# Altium project Battman.PrjPcb (part 1 of 2)
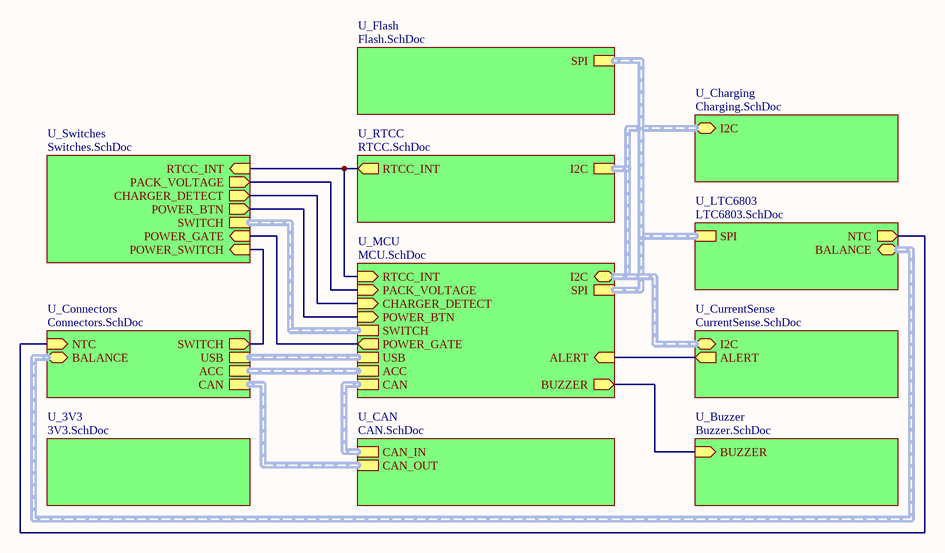
[diagram p0: BMS.SchDoc]
13 sheets, 248 parts. Net scope: hierarchical (ports join the sheet entries above them; power ports are global).
Board file: BMS.PcbDoc
Sheets:
  BMS.SchDoc
    U_3V3 = 3V3.SchDoc
    U_MCU = MCU.SchDoc
    U_Switches = Switches.SchDoc
    U_LTC6803 = LTC6803.SchDoc
      12 = Cell.SchDoc
      11 = Cell.SchDoc
      10 = Cell.SchDoc
      9 = Cell.SchDoc
      8 = Cell.SchDoc
      7 = Cell.SchDoc
      6 = Cell.SchDoc
      5 = Cell.SchDoc
      4 = Cell.SchDoc
      3 = Cell.SchDoc
      2 = Cell.SchDoc
      1 = Cell.SchDoc
    U_Charging = Charging.SchDoc
    U_Connectors = Connectors.SchDoc
    U_CurrentSense = CurrentSense.SchDoc
    U_CAN = CAN.SchDoc
    U_RTCC = RTCC.SchDoc
    U_Buzzer = Buzzer.SchDoc
    U_Flash = Flash.SchDoc

## Sheet BMS.SchDoc
size A; SheetNumber: 1

### Sub-sheets
U_3V3 = 3V3.SchDoc: no entries
U_Buzzer = Buzzer.SchDoc: BUZZER (in)
U_CAN = CAN.SchDoc: CAN_IN (harness CAN Input), CAN_OUT (harness CAN Output)
U_Charging = Charging.SchDoc: I2C (harness I2C)
U_Connectors = Connectors.SchDoc: USB (harness USB), ACC (harness Accessory Outputs), SWITCH (out), CAN (harness CAN Output), NTC (in), BALANCE (harness Balance)
U_CurrentSense = CurrentSense.SchDoc: ALERT (out), I2C (harness I2C)
U_Flash = Flash.SchDoc: SPI (harness SPI)
U_LTC6803 = LTC6803.SchDoc: SPI (harness SPI), NTC (out), BALANCE (harness Balance)
U_MCU = MCU.SchDoc: CHARGER_DETECT (in), POWER_BTN (in), POWER_GATE (out), SPI (harness SPI), USB (harness USB), CAN (harness CAN Input), ACC (harness Accessory Outputs), SWITCH (harness Switches), I2C (harness I2C), RTCC_INT (in), PACK_VOLTAGE (in), ALERT (in), BUZZER (out)
U_RTCC = RTCC.SchDoc: I2C (harness I2C), RTCC_INT (out)
U_Switches = Switches.SchDoc: POWER_GATE (in), POWER_BTN (out), CHARGER_DETECT (out), SWITCH (harness Switches), POWER_SWITCH (in), RTCC_INT (in), PACK_VOLTAGE (out)

### Nets
NetC1_2: sheet U_LTC6803/NTC, sheet U_Connectors/NTC
NetJP4_1: sheet U_Switches/POWER_SWITCH, sheet U_Connectors/SWITCH
NetQ1_1: sheet U_MCU/POWER_BTN, sheet U_Switches/POWER_BTN
NetQ9_1: sheet U_MCU/RTCC_INT, sheet U_Switches/RTCC_INT, sheet U_RTCC/RTCC_INT
NetQ11_1: sheet U_MCU/POWER_GATE, sheet U_Switches/POWER_GATE
NetQ13_1: sheet U_MCU/BUZZER, sheet U_Buzzer/BUZZER
NetR22_1: sheet U_MCU/PACK_VOLTAGE, sheet U_Switches/PACK_VOLTAGE
NetR39_1: sheet U_MCU/CHARGER_DETECT, sheet U_Switches/CHARGER_DETECT
NetR52_1: sheet U_MCU/ALERT, sheet U_CurrentSense/ALERT

### Buses and harness runs
harness sheet U_CAN/CAN_IN = sheet U_MCU/CAN
harness sheet U_CAN/CAN_OUT = sheet U_Connectors/CAN
harness sheet U_Charging/I2C = sheet U_CurrentSense/I2C = sheet U_MCU/I2C = sheet U_RTCC/I2C
harness sheet U_Connectors/ACC = sheet U_MCU/ACC
harness sheet U_Connectors/BALANCE = sheet U_LTC6803/BALANCE
harness sheet U_Connectors/USB = sheet U_MCU/USB
harness sheet U_Flash/SPI = sheet U_LTC6803/SPI = sheet U_MCU/SPI
harness sheet U_MCU/SWITCH = sheet U_Switches/SWITCH

## Sheet 3V3.SchDoc
size A; SheetNumber: 2
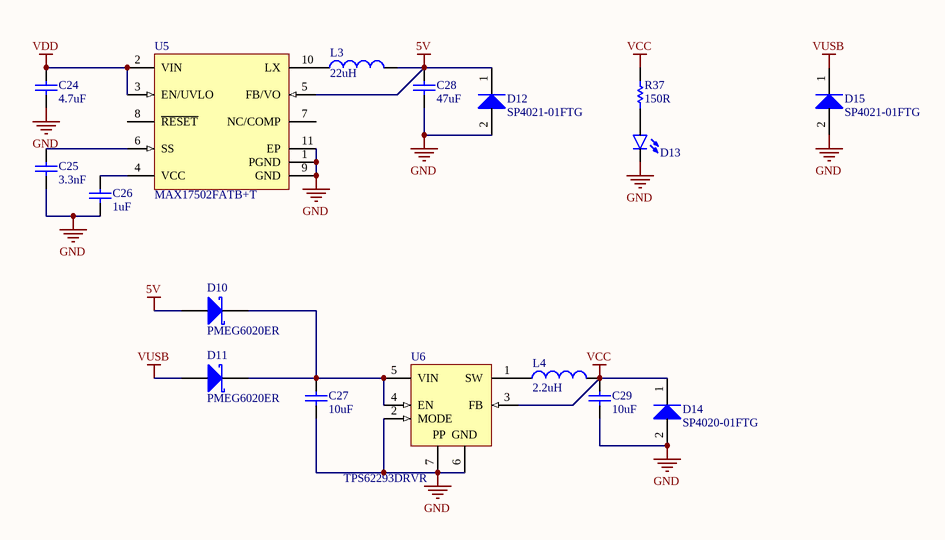
[diagram p1: 3V3.SchDoc]

### Parts
C24  value 4.7uF  [C1210[3225X200]]  (hidden comment: 4.7uF 100V 1210)
C25  value 3.3nF  [C0402[1005X55]]  (hidden comment: 3.3nF 50V 0402)
C26  value 1uF  [C0402[1005X55]]  (hidden comment: 1uF 6.3V 0402)
C27  value 10uF  [C0402[1005X55]]  (hidden comment: 10uF 6.3V 0402)
C28  value 47uF  [C1210[3225X250]]  (hidden comment: 47uF 6.3V 1210)
C29  value 10uF  [C0402[1005X55]]  (hidden comment: 10uF 6.3V 0402)
D10  PMEG6020ER  [SOD-123]
D11  PMEG6020ER  [SOD-123]
D12  SP4021-01FTG  [SOD-323]
D13  LED_0603_GREEN_5mA  [LED0603]  (value not drawn)
D14  SP4020-01FTG  [SOD323]
D15  SP4021-01FTG  [SOD-323]
L3  value 22uH  [SDR0604]
L4  2.2uH  [IND0805]
R37  value 150R  [R0402[1005]]  (hidden comment: 150R 1% 0402)
U5  MAX17502FATB+T  [TDFN-10-EP]
U6  TPS62293DRVR  [WSON-6]

### Nets
5V: C28.2 D10.2(A) D12.1(K) L3.2 U5.5(FB/VO)
GND: C24.1 C25.1 C26.1 C27.1 C28.1 C29.1 D12.2(A) D13.C D14.2(A) D15.2(A) U5.1(PGND) U5.9(GND) U5.11(EP) U6.2(MODE) U6.6(GND) U6.7(EP)
VCC: C29.2 D14.1(K) L4.2 R37.2 U6.3(FB)
VDD: C24.2 U5.2(VIN) U5.3(EN/UVLO)
VUSB: D11.2(A) D15.1(K)
NetC25_2: C25.2 U5.6(SS)
NetC26_2: C26.2 U5.4(VCC)
NetC27_2: C27.2 D10.1(K) D11.1(K) U6.4(EN) U6.5(VIN)
NetD13_A: D13.A R37.1
NetL3_1: L3.1 U5.10(LX)
NetL4_1: L4.1 U6.1(SW)

Not connected (* = marked no-connect by the designer): U5 7(NC/COMP) 8(~{RESET})

### Notes on the sheet
- (in symbol TPS62293DRVR) PP

### Library data of the parts
C24 = CAP_4.7uF_100V_1210_10%: 4.7uF 100V 10% 1210 (3225 Metric); PartNumber: GRJ32DC72A475KE11L; Manufacturer: Murata; Tolerance: 10%; Mounting Technology: Surface Mount; PackageReference: 1210; PackageDescription: 1210 (3225 Metric); Voltage: 100V
C25 = CAP_3.3nF_50V_0402_10%: 3.3nF 50V 10% 0402 (1005 Metric); PartNumber: GRM155R71H332KA01D; Manufacturer: Murata; Tolerance: 10%; Mounting Technology: Surface Mount; PackageReference: 0402; PackageDescription: 0402 (1005 Metric); Voltage: 50V
C26 = CAP_1uF_6.3V_0402_10%: 1uF 6.3V 10% 0402 (1005 Metric); PartNumber: GRM155R70J105KA12D; Manufacturer: Murata; Tolerance: 10%; Mounting Technology: Surface Mount; PackageReference: 0402; PackageDescription: 0402 (1005 Metric); Voltage: 6.3V
C27 C29 = CAP_10uF_6.3V_0402_20%: 10uF 6.3V 20% 0402 (1005 Metric); PartNumber: GRM155R60J106ME44D; Manufacturer: Murata; Tolerance: 20%; Mounting Technology: Surface Mount; PackageReference: 0402; PackageDescription: 0402 (1005 Metric); Voltage: 6.3V
C28 = CAP_47uF_6.3V_1210_10%: 47uF 6.3V 10% 1210 (3225 Metric); PartNumber: GRM32ER70J476KE20L; Manufacturer: Murata; Tolerance: 10%; Mounting Technology: Surface Mount; PackageReference: 1210; PackageDescription: 1210 (3225 Metric); Voltage: 6.3V
D10 D11 = PMEG6020ER: PartNumber: PMEG6020ER,115; Manufacturer: NXP Semiconductors; PackageReference: SOD-123W; PackageDescription: SOD, 2-Leads, Body 2.69x1.6mm; Mounting Technology: Surface Mount
D12 D15 = SP4021-01FTG: Manufacturer: Littelfuse; PartNumber: SP4021-01FTG; PackageReference: SOD-323-2; Mounting Technology: Surface Mount
D13 = LED_0603_GREEN_5mA: PartNumber: LTST-C193TGKT-5A; Manufacturer: Lite-On Inc.; PackageReference: 0603; PackageDescription: 0603 (1608 Metric); Mounting Technology: Surface Mount
D14 = SP4020-01FTG: Manufacturer: Littelfuse; PartNumber: SP4020-01FTG; PackageReference: SOD-323-2; Mounting Technology: Surface Mount
L3 = SDR0604-220YL: 22uH 30% 1.1A 0604; Manufacturer: Bourns; PartNumber: SDR0604-220YL; PackageReference: SDR0604; Mounting Technology: Surface Mount
L4 = IND_2.2uH_1.7A_0805_20%: 2.2uH 20% 1.7A 0805; PartNumber: LQM21PN2R2MGHL; Manufacturer: Murata; PackageReference: 0805; PackageDescription: 0805 (2012 metric); Value: 2.2uH; Mounting Technology: Surface Mount; Current: 1.7A
R37 = RES_150R_0402_1%: 150R 0.063W 1% 0402 (1005 Metric); Manufacturer: KOA Speer; PartNumber: RK73H1ETTP1500F; Power: 0.063W; Tolerance: 1%; Mounting Technology: Surface Mount; PackageReference: 0402; PackageDescription: 0402 (1005 Metric); ComponentLink1Description: Datasheet; ComponentLink1URL: http://www.koaspeer.com/catimages/Products/RK73H/RK73H.pdf
U5 = MAX17502FATB+T: Ultra-Small, High-Efficiency, Synchronous Step-Down DC-DC Converter, 4.5 to 60 V, 1 A, -40 to 125 degC, 10-Pin TDFN (T1032N+1), RoHS, Tape and Reel; Manufacturer: Maxim Integrated; Mounting Technology: Surface Mount; PartNumber: MAX17502FATB+T; PackageReference: TDFN-10-EP
U6 = TPS62293DRVR: Voltage Regulators - Switching Regulators 2.25MHz 1A Step-Down Cnvrtr; Manufacturer: Texas Instruments; PartNumber: TPS62293DRVR; PackageReference: WSON-6; PackageDescription: SON, 6-Leads, Body 2x2mm, Pitch 0.65mm, Thermal Pad 1.6x1mm, TI Recommended; Mounting Technology: Surface Mount

## Sheet MCU.SchDoc
size A; SheetNumber: 3
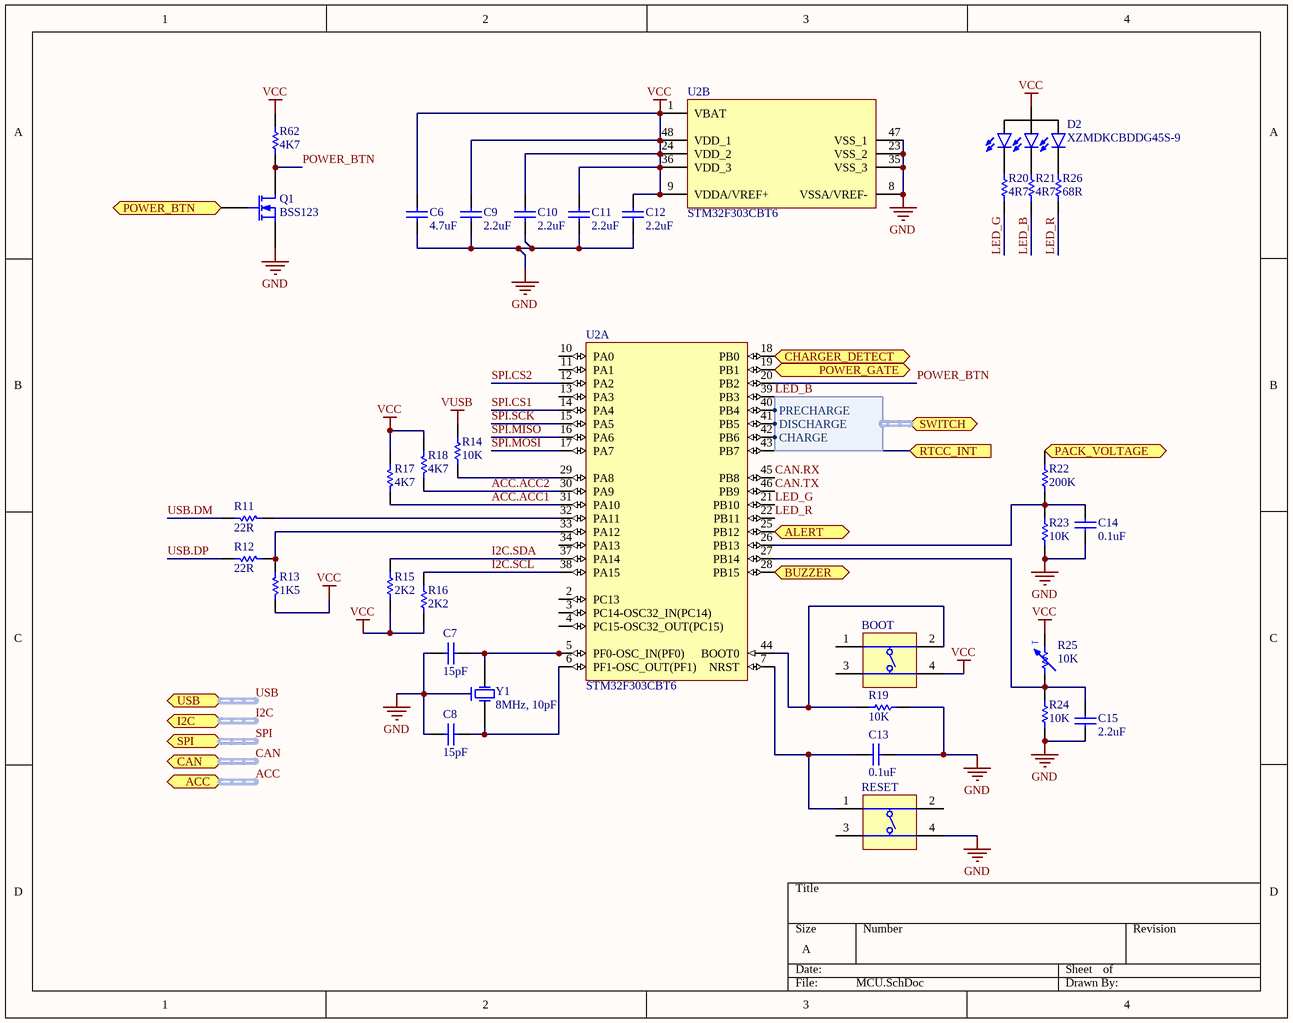
[diagram p2: MCU.SchDoc]

### Parts
BOOT  (no value)  [SWITCH]
C6  value 4.7uF  [C0402[1005X55]]  (hidden comment: 4.7uF 6.3V 0402)
C7  value 15pF  [C0402[1005X55]]  (hidden comment: 15pF 50V 0402)
C8  value 15pF  [C0402[1005X55]]  (hidden comment: 15pF 50V 0402)
C9  value 2.2uF  [C0402[1005X55]]  (hidden comment: 2.2uF 6.3V 0402)
C10  value 2.2uF  [C0402[1005X55]]  (hidden comment: 2.2uF 6.3V 0402)
C11  value 2.2uF  [C0402[1005X55]]  (hidden comment: 2.2uF 6.3V 0402)
C12  value 2.2uF  [C0402[1005X55]]  (hidden comment: 2.2uF 6.3V 0402)
C13  value 0.1uF  [C0402[1005X55]]  (hidden comment: 0.1uF 6.3V 0402)
C14  value 0.1uF  [C0402[1005X55]]  (hidden comment: 0.1uF 6.3V 0402)
C15  value 2.2uF  [C0402[1005X55]]  (hidden comment: 2.2uF 6.3V 0402)
D2  XZMDKCBDDG45S-9  [XZMDKCBDDG45S-9]
Q1  BSS123  [SOT323-3]
R11  value 22R  [R0402[1005]]  (hidden comment: 22R 1% 0402)
R12  value 22R  [R0402[1005]]  (hidden comment: 22R 1% 0402)
R13  value 1K5  [R0402[1005]]  (hidden comment: 1K5 1% 0402)
R14  value 10K  [R0402[1005]]  (hidden comment: 10K 1% 0402)
R15  value 2K2  [R0402[1005]]  (hidden comment: 2K2 1% 0402)
R16  value 2K2  [R0402[1005]]  (hidden comment: 2K2 1% 0402)
R17  value 4K7  [R0402[1005]]  (hidden comment: 4K7 1% 0402)
R18  value 4K7  [R0402[1005]]  (hidden comment: 4K7 1% 0402)
R19  value 10K  [R0402[1005]]  (hidden comment: 10K 1% 0402)
R20  value 4R7  [R0402[1005]]  (hidden comment: 4R7 1% 0402)
R21  value 4R7  [R0402[1005]]  (hidden comment: 4R7 1% 0402)
R22  value 200K  [R0402[1005]]  (hidden comment: 200K 1% 0402)
R23  value 10K  [R0402[1005]]  (hidden comment: 10K 1% 0402)
R24  value 10K  [R0402[1005]]  (hidden comment: 10K 1% 0402)
R25  value 10K  [R0402[1005]]  (hidden comment: 10K 0.5% 0402)
R26  value 68R  [R0402[1005]]  (hidden comment: 68R 1% 0402)
R62  value 4K7  [R0402[1005]]  (hidden comment: 4K7 1% 0402)
RESET  (no value)  [SWITCH]
U2  STM32F303CBT6  [LQFP-48]  (parts A,B of 2)
Y1  8MHz, 10pF  [ABRA-ABM3B-4_V]

### Ports
ACC (harness Accessory Outputs), ALERT (in), BUZZER (out), CAN (harness CAN Input), CHARGER_DETECT (in), I2C (harness I2C), PACK_VOLTAGE (in), POWER_BTN (in), POWER_GATE (out), RTCC_INT (in), SPI (harness SPI), SWITCH (harness Switches), USB (harness USB)

### Harnesses
Switches: CHARGE, DISCHARGE, PRECHARGE

### Nets
GND: C6.1 C7.1 C8.1 C9.1 C10.1 C11.1 C12.1 C13.2 C14.1 C15.1 Q1.2(S) R19.2 R23.1 R24.1 RESET.4(T3) U2.8(VSSA/VREF-) U2.23(VSS_2) U2.35(VSS_3) U2.47(VSS_1) Y1.2
VCC: BOOT.4(T3) C6.2 C9.2 C10.2 C11.2 C12.2 D2.2(A) R13.1 R15.2 R16.2 R17.2 R18.2 R25.2 R62.2 U2.1(VBAT) U2.9(VDDA/VREF+) U2.24(VDD_2) U2.36(VDD_3) U2.48(VDD_1)
VUSB: R14.2
ACC.ACC1: R17.1 U2.31(PA10)
ACC.ACC2: R18.1 U2.30(PA9)
CAN.RX: U2.45(PB8)
CAN.TX: U2.46(PB9)
I2C.SCL: R16.1 U2.38(PA15)
I2C.SDA: R15.1 U2.37(PA14)
LED_B: R21.1 U2.39(PB3)
LED_G: R20.1 U2.21(PB10)
LED_R: R26.1 U2.22(PB11)
POWER_BTN: Q1.3(D) R62.1 U2.20(PB2)
SPI.CS1: U2.14(PA4)
SPI.CS2: U2.12(PA2)
SPI.MISO: U2.16(PA6)
SPI.MOSI: U2.17(PA7)
SPI.SCK: U2.15(PA5)
USB.DM: R11.2
USB.DP: R12.2
NetBOOT_2: BOOT.2(T2) R19.1 U2.44(BOOT0)
NetC7_2: C7.2 U2.5(PF0-OSC_IN(PF0)) Y1.1(X1)
NetC8_2: C8.2 U2.6(PF1-OSC_OUT(PF1)) Y1.3(X2)
NetC13_1: C13.1 RESET.1(T1) U2.7(NRST)
NetC14_2: C14.2 R22.2 R23.2 U2.26(PB13)
NetC15_2: C15.2 R24.2 R25.1 U2.27(PB14)
NetD2_1: D2.1(K_Red) R26.2
NetD2_3: D2.3(K_Blue) R21.2
NetD2_4: D2.4(K_Green) R20.2
NetQ1_1: Q1.1(G) ; port POWER_BTN
NetQ9_1: U2.43(PB7) ; port RTCC_INT
NetQ11_1: U2.19(PB1) ; port POWER_GATE
NetQ13_1: U2.28(PB15) ; port BUZZER
NetR11_1: R11.1 U2.32(PA11)
NetR12_1: R12.1 R13.2 U2.33(PA12)
NetR14_1: R14.1 U2.29(PA8)
NetR22_1: R22.1 ; port PACK_VOLTAGE
NetR39_1: U2.18(PB0) ; port CHARGER_DETECT
NetR52_1: U2.25(PB12) ; port ALERT
NetU2_40: U2.40(PB4) ; port SWITCH.PRECHARGE
NetU2_41: U2.41(PB5) ; port SWITCH.DISCHARGE
NetU2_42: U2.42(PB6) ; port SWITCH.CHARGE

Not connected (* = marked no-connect by the designer): BOOT 1(T1) 3(T3); RESET 2(T2) 3(T3); U2 2(PC13) 3(PC14-OSC32_IN(PC14)) 4(PC15-OSC32_OUT(PC15)) 10(PA0) 11(PA1) 13(PA3) 34(PA13)

### Buses and harness runs
harness ACC = port ACC
harness CAN = port CAN
harness I2C = port I2C
harness SPI = port SPI
harness USB = port USB

### Notes on the sheet
- (in symbol NTC_10K_0402_0.5%) T

### Library data of the parts
BOOT RESET = DIPT-DTSM-6: Switch, SPNO Push Button SMD; Manufacturer: C&K Components; PartNumber: PTS810 SJM 250 SMTR LFS; Packing Type: Tape&Reel; Mechanical Life: 200,000 cycles; ComponentLink2URL: http://www.dip.com.tw/Products_tact.htm; ComponentLink1URL: http://www.dip.com.tw/; ComponentLink3URL: http://www.dip.com.tw/PDF/pro_tact/DTSM_G_-6_2_-V.pdf; PackageDescription: Switch, Surface Mount, 4 Leads, Body 4.6x2.8mm, Height 1.9mm; ComponentLink2Description: Datasheet; ComponentLink3Description: Package Specification; ComponentLink1Description: Manufacturer URL; PackageReference: PTS810; Mounting Technology: Surface Mount
C6 = CAP_4.7uF_6.3V_0402_20%: 4.7uF 6.3V 20% 0402 (1005 Metric); PartNumber: GRM155R60J475ME47D; Manufacturer: Murata; Tolerance: 20%; Mounting Technology: Surface Mount; PackageReference: 0402; PackageDescription: 0402 (1005 Metric); Voltage: 6.3V
C7 C8 = CAP_15pF_50V_0402_5%: 15pF 50V 5% 0402 (1005 Metric); PartNumber: GRM1555C1H150JA01D; Manufacturer: Murata; Tolerance: 5%; Mounting Technology: Surface Mount; PackageReference: 0402; PackageDescription: 0402 (1005 Metric); Voltage: 50V
C9-C12 C15 = CAP_2.2uF_6.3V_0402_20%: 2.2uF 6.3V 20% 0402 (1005 Metric); PartNumber: GRM155R60J225ME15D; Manufacturer: Murata; Tolerance: 20%; Mounting Technology: Surface Mount; PackageReference: 0402; PackageDescription: 0402 (1005 Metric); Voltage: 6.3V
C13 C14 = CAP_0.1uF_6.3V_0402_10%: 0.1uF 6.3V 10% 0402 (1005 Metric); PartNumber: GRM155R70J104KA01D; Manufacturer: Murata; Tolerance: 10%; Mounting Technology: Surface Mount; PackageReference: 0402; PackageDescription: 0402 (1005 Metric); Voltage: 6.3V
D2 = XZMDKCBDDG45S-9: Manufacturer: SunLED; PartNumber: XZMDKCBDDG45S-9; PackageReference: 4-PLCC; Mounting Technology: Surface Mount; PackageDescription: 4-SMD, Gull Wing,  3.20mm L x 2.80mm W
Q1 = BSS123WQ-7-F: N-Channel MOSFET; Manufacturer: Diodes Incorporated; PackageReference: SOT-323-3; PartNumber: BSS123WQ-7-F; Mounting Technology: Surface Mount
R11 R12 = RES_22R_0402_1%: 22R 0.063W 1% 0402 (1005 Metric); Manufacturer: KOA Speer; PartNumber: RK73H1ETTP22R0F; Power: 0.063W; Tolerance: 1%; Mounting Technology: Surface Mount; PackageReference: 0402; PackageDescription: 0402 (1005 Metric); ComponentLink1Description: Datasheet; ComponentLink1URL: http://www.koaspeer.com/catimages/Products/RK73H/RK73H.pdf
R13 = RES_1K5_0402_1%: 1K5 0.063W 1% 0402 (1005 Metric); Manufacturer: KOA Speer; PartNumber: RK73H1ETTP1501F; Tolerance: 1%; Power: 0.063W; Mounting Technology: Surface Mount; PackageReference: 0402; PackageDescription: 0402 (1005 Metric); ComponentLink1Description: Datasheet; ComponentLink1URL: http://www.koaspeer.com/catimages/Products/RK73H/RK73H.pdf
R14 R19 R23 R24 = RES_10K_0402_1%: 10K 0.063W 1% 0402 (1005 Metric); Manufacturer: KOA Speer; PartNumber: RK73H1ETTP1002F; Tolerance: 1%; Power: 0.063W; Mounting Technology: Surface Mount; PackageReference: 0402; PackageDescription: 0402 (1005 Metric); ComponentLink1Description: Datasheet; ComponentLink1URL: http://www.koaspeer.com/catimages/Products/RK73H/RK73H.pdf
R15 R16 = RES_2K2_0402_1%: 2K2 0.063W 1% 0402 (1005 Metric); Manufacturer: KOA Speer; PartNumber: RK73H1ETTP2201F; Tolerance: 1%; Power: 0.063W; Mounting Technology: Surface Mount; PackageReference: 0402; PackageDescription: 0402 (1005 Metric); ComponentLink1Description: Datasheet; ComponentLink1URL: http://www.koaspeer.com/catimages/Products/RK73H/RK73H.pdf
R17 R18 R62 = RES_4K7_0402_1%: 4K7 0.063W 1% 0402 (1005 Metric); Manufacturer: KOA Speer; PartNumber: RK73H1ETTP4701F; Tolerance: 1%; Power: 0.063W; Mounting Technology: Surface Mount; PackageReference: 0402; PackageDescription: 0402 (1005 Metric); ComponentLink1Description: Datasheet; ComponentLink1URL: http://www.koaspeer.com/catimages/Products/RK73H/RK73H.pdf
R20 R21 = RES_4R7_0402_1%: 4R7 0.063W 1% 0402 (1005 Metric); Manufacturer: KOA Speer; PartNumber: RK73H1ETTP4R70F; Power: 0.063W; Tolerance: 1%; Mounting Technology: Surface Mount; PackageReference: 0402; PackageDescription: 0402 (1005 Metric); ComponentLink1Description: Datasheet; ComponentLink1URL: http://www.koaspeer.com/catimages/Products/RK73H/RK73H.pdf
R22 = RES_200K_0402_1%: 200K 0.063W 1% 0402 (1005 Metric); Manufacturer: KOA Speer; PartNumber: RK73H1ETTP2003F; Tolerance: 1%; Power: 0.063W; Mounting Technology: Surface Mount; PackageReference: 0402; PackageDescription: 0402 (1005 Metric); ComponentLink1Description: Datasheet; ComponentLink1URL: http://www.koaspeer.com/catimages/Products/RK73H/RK73H.pdf
R25 = NTC_10K_0402_0.5%: NTC 10K 0.5% 0402 (1005 Metric); PartNumber: NCP15XH103D03RC; Manufacturer: Murata; Power: 0.1W; Tolerance: 0.5%; Mounting Technology: Surface Mount; PackageReference: 0402; PackageDescription: 0402 (1005 Metric)
R26 = RES_68R_0402_1%: 68R 0.063W 1% 0402 (1005 Metric); Manufacturer: KOA Speer; PartNumber: RK73H1ETTP68R0F; Tolerance: 1%; Power: 0.063W; Mounting Technology: Surface Mount; PackageReference: 0402; PackageDescription: 0402 (1005 Metric); ComponentLink1Description: Datasheet; ComponentLink1URL: http://www.koaspeer.com/catimages/Products/RK73H/RK73H.pdf
U2 = STM32F303CBT6: Manufacturer: STMicroelectronics; PackageReference: LQFP-48; Mounting Technology: Surface Mount; PartNumber: STM32F303CBT6; PackageDescription: QFP, 48-Leads, Body 7x7mm, Pitch 0.5mm
Y1 = ABRA-ABM3B-4: PartNumber: ABM3B-8.000MHZ-10-1UT; Manufacturer: ABRACON; Mounting Technology: Surface Mount; PackageReference: 2012; PackageDescription: 2012 (5032 metric)

## Sheet Switches.SchDoc
size A; SheetNumber: 7
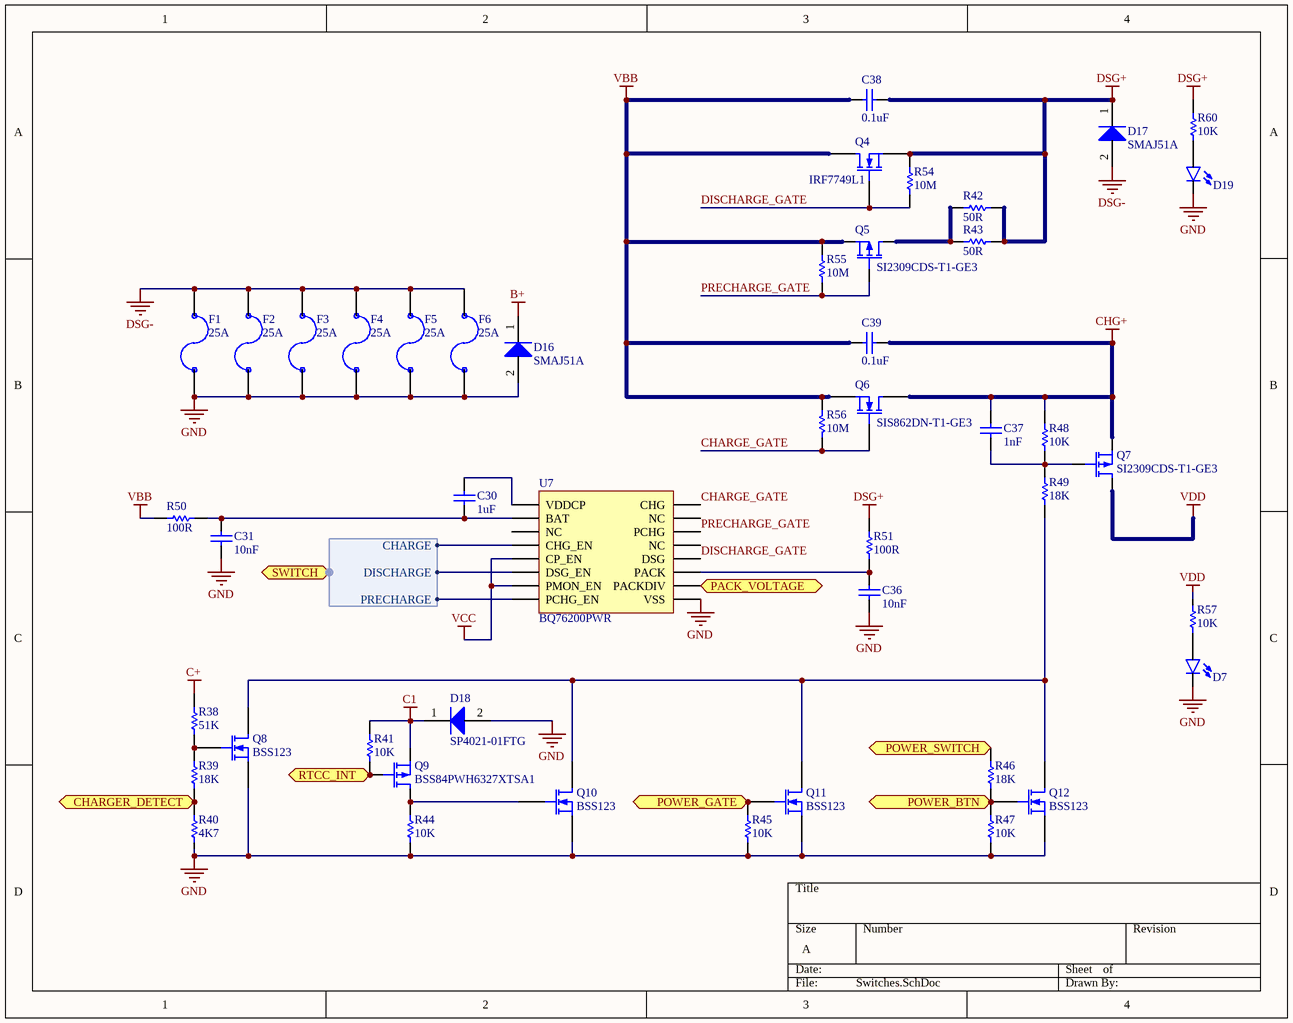
[diagram p3: Switches.SchDoc]

### Parts
C30  value 1uF  [C0603[1608X92]]  (hidden comment: 1uF 50V 0603)
C31  value 10nF  [C0402[1005X55]]  (hidden comment: 10nF 100V 0402)
C36  value 10nF  [C0402[1005X55]]  (hidden comment: 10nF 100V 0402)
C37  value 1nF  [C0402[1005X55]]  (hidden comment: 1nF 50V 0402)
C38  value 0.1uF  [C0402[1005X55]]  (hidden comment: 0.1uF 100V 0402)
C39  value 0.1uF  [C0402[1005X55]]  (hidden comment: 0.1uF 100V 0402)
D7  LED-BLUE  [LED0603]  (value not drawn)
D16  SMAJ51A  [DO-214AC]
D17  SMAJ51A  [DO-214AC]
D18  SP4021-01FTG  [SOD-323]
D19  LED-BLUE  [LED0603]  (value not drawn)
F1  Current: 25A  [1206_FUSE]  (hidden comment: FUSE 1206)
F2  Current: 25A  [1206_FUSE]  (hidden comment: FUSE 1206)
F3  Current: 25A  [1206_FUSE]  (hidden comment: FUSE 1206)
F4  Current: 25A  [1206_FUSE]  (hidden comment: FUSE 1206)
F5  Current: 25A  [1206_FUSE]  (hidden comment: FUSE 1206)
F6  Current: 25A  [1206_FUSE]  (hidden comment: FUSE 1206)
Q4  IRF7749L1  [DIRECTFET-9]
Q5  SI2309CDS-T1-GE3  [SOT23-3]
Q6  SIS862DN-T1-GE3  [PowerPak-1212-8]
Q7  SI2309CDS-T1-GE3  [SOT23-3]
Q8  BSS123  [SOT323-3]
Q9  BSS84PWH6327XTSA1  [SOT323-3]
Q10  BSS123  [SOT323-3]
Q11  BSS123  [SOT323-3]
Q12  BSS123  [SOT323-3]
R38  value 51K  [R0402[1005]]  (hidden comment: 51K 1% 0402)
R39  value 18K  [R0402[1005]]  (hidden comment: 18K 1% 0402)
R40  value 4K7  [R0402[1005]]  (hidden comment: 4K7 1% 0402)
R41  value 10K  [R0402[1005]]  (hidden comment: 10K 1% 0402)
R42  value 50R  [R1206[3216]]  (hidden comment: 50R 2% 1206)
R43  value 50R  [R1206[3216]]  (hidden comment: 50R 2% 1206)
R44  value 10K  [R0402[1005]]  (hidden comment: 10K 1% 0402)
R45  value 10K  [R0402[1005]]  (hidden comment: 10K 1% 0402)
R46  value 18K  [R0402[1005]]  (hidden comment: 18K 1% 0402)
R47  value 10K  [R0402[1005]]  (hidden comment: 10K 1% 0402)
R48  value 10K  [R0402[1005]]  (hidden comment: 10K 1% 0402)
R49  value 18K  [R0402[1005]]  (hidden comment: 18K 1% 0402)
R50  value 100R  [R0402[1005]]  (hidden comment: 100R 1% 0402)
R51  value 100R  [R0402[1005]]  (hidden comment: 100R 1% 0402)
R54  value 10M  [R0402[1005]]  (hidden comment: 10M 1% 0402)
R55  value 10M  [R0402[1005]]  (hidden comment: 10M 1% 0402)
R56  value 10M  [R0402[1005]]  (hidden comment: 10M 1% 0402)
R57  value 10K  [R0603[1608]]  (hidden comment: 10K 1% 0603)
R60  value 10K  [R0603[1608]]  (hidden comment: 10K 1% 0603)
U7  BQ76200PWR  [TSSOP-16]

### Ports
CHARGER_DETECT (out), PACK_VOLTAGE (out), POWER_BTN (out), POWER_GATE (in), POWER_SWITCH (in), RTCC_INT (in), SWITCH (harness Switches)

### Harnesses
Switches: CHARGE, DISCHARGE, PRECHARGE

### Nets
B+: D16.1(K)
C1: D18.1(K) Q9.2(S) R41.2
C+: R38.2
CHG+: C37.2 C39.2 Q6.3(D) Q7.3(S) R48.2
DSG+: C38.2 D17.1(K) Q4.2(S) R42.2 R43.2 R51.2 R54.2 R60.2
DSG-: D17.2(A) F1.1 F2.1 F3.1 F4.1 F5.1 F6.1
GND: C31.1 C36.1 D7.C D16.2(A) D18.2(A) D19.C F1.2 F2.2 F3.2 F4.2 F5.2 F6.2 Q8.2(S) Q10.2(S) Q11.2(S) Q12.2(S) R40.1 R44.1 R45.1 R47.1 U7.9(VSS)
VBB: C38.1 C39.1 Q4.3(D) Q5.3(S) Q6.1(S) R50.1 R55.2 R56.2
VCC: U7.5(CP_EN) U7.7(PMON_EN)
VDD: Q7.2(D) R57.2
CHARGE_GATE: Q6.2(G) R56.1 U7.16(CHG)
DISCHARGE_GATE: Q4.1(G) R54.1 U7.12(DSG)
PRECHARGE_GATE: Q5.1(G) R55.1 U7.14(PCHG)
NetC30_1: C30.1 C31.2 R50.2 U7.2(BAT)
NetC30_2: C30.2 U7.1(VDDCP)
NetC36_2: C36.2 R51.1 U7.11(PACK)
NetC37_1: C37.1 Q7.1(G) R48.1 R49.2
NetD7_A: D7.A R57.1
NetD19_A: D19.A R60.1
NetJP4_1: R46.2 ; port POWER_SWITCH
NetQ1_1: Q12.1(G) R46.1 R47.2 ; port POWER_BTN
NetQ5_2: Q5.2(D) R42.1 R43.1
NetQ8_1: Q8.1(G) R38.1 R39.2
NetQ8_3: Q8.3(D) Q10.3(D) Q11.3(D) Q12.3(D) R49.1
NetQ9_1: Q9.1(G) R41.1 ; port RTCC_INT
NetQ9_3: Q9.3(D) Q10.1(G) R44.2
NetQ11_1: Q11.1(G) R45.2 ; port POWER_GATE
NetR22_1: U7.10(PACKDIV) ; port PACK_VOLTAGE
NetR39_1: R39.1 R40.2 ; port CHARGER_DETECT
NetU2_40: U7.8(PCHG_EN) ; port SWITCH.PRECHARGE
NetU2_41: U7.6(DSG_EN) ; port SWITCH.DISCHARGE
NetU2_42: U7.4(CHG_EN) ; port SWITCH.CHARGE

Not connected (* = marked no-connect by the designer): U7 3(NC) 13(NC) 15(NC)

### Library data of the parts
C30 = CAP_1uF_50V_0603_10%: 1uF 50V 10% 0603 (1608 Metric); PartNumber: GRM188R61H105KAALD; Manufacturer: Murata; Tolerance: 10%; Mounting Technology: Surface Mount; PackageReference: 0603; PackageDescription: 0603 (1608 Metric); Voltage: 50V
C31 C36 = CAP_10nF_100V_0402_10%: 10nF 100V 10% 0402 (1005 Metric); PartNumber: C1005X7S2A103K050BB; Manufacturer: TDK; Tolerance: 10%; Mounting Technology: Surface Mount; PackageReference: 0402; PackageDescription: 0402 (1005 Metric); Voltage: 100V
C37 = CAP_1nF_50V_0402_5%: 1nF 50V 5% 0402 (1005 Metric); PartNumber: GRM1555C1H102JA01D; Manufacturer: Murata; Mounting Technology: Surface Mount; PackageReference: 0402; PackageDescription: 0402 (1005 Metric); Voltage: 50V; Tolerance: 5%
C38 C39 = CAP_0.1uF_100V_0402_10%: 0.1uF 100V 10% 0402 (1005 Metric); PartNumber: GRM155R62A104KE14D; Manufacturer: Murata; Mounting Technology: Surface Mount; PackageReference: 0402; PackageDescription: 0402 (1005 Metric); Voltage: 100V; Tolerance: 10%
D7 D19 = LED_0603_GREEN_5mA: as D13 on sheet 3V3; PackageReference: 0603; PackageDescription: 0603 (1608 Metric); Mounting Technology: Surface Mount
D16 D17 = SMAJ51A-E3/61: Manufacturer: Vishay; PartNumber: SMAJ51A-E3/61; PackageReference: DO-214AC; Mounting Technology: Surface Mount; PackageDescription: DO-214AC, 2 Leads
D18 = SP4021-01FTG: Manufacturer: Littelfuse; PartNumber: SP4021-01FTG; PackageReference: SOD-323-2; Mounting Technology: Surface Mount
F1-F6 = FUSE 1206: Surface Mount Fuses UST 1206 FUSE 25A F; PartNumber: 3413.0332.22; Manufacturer: Schurter; Mounting Technology: Surface Mount; PackageReference: 1206; PackageDescription: 1206 (3216 Metric)
Q4 = IRF7749L2: N-Channel MOSFET; PartNumber: IRF7749L1TRPBF; Manufacturer: Infineon Technologies; PackageReference: DIRECTFET L8; PackageDescription: DirectFET™ Isometric L8; Mounting Technology: Surface Mount
Q5 Q7 = SI2309CDS-T1-GE3: P-Channel MOSFET; Manufacturer: Vishay; PackageReference: SOT23-3; Mounting Technology: Surface Mount; PartNumber: SI2309CDS-T1-GE3
Q6 = SIS862DN-T1-GE3: N-Channel MOSFET; Manufacturer: Vishay; PackageReference: PowerPAK-1212-8; PartNumber: SIS862DN-T1-GE3; Mounting Technology: Surface Mount
Q8 Q10-Q12 = BSS123WQ-7-F: as Q1 on sheet MCU; PackageReference: SOT-323-3; PartNumber: BSS123WQ-7-F; Mounting Technology: Surface Mount
Q9 = BSS84PW H6327: P-Channel MOSFET; Manufacturer: Infineon; Mounting Technology: Surface Mount; PartNumber: BSS84PWH6327XTSA1; PackageReference: SOT323-3
R38 = RES_51K_0402_1%: 51K 0.063W 1% 0402 (1005 Metric); Manufacturer: KOA Speer; PartNumber: RK73H1ETTP5102F; Power: 0.063W; Tolerance: 1%; Mounting Technology: Surface Mount; PackageReference: 0402; PackageDescription: 0402 (1005 Metric); ComponentLink1Description: Datasheet; ComponentLink1URL: http://www.koaspeer.com/catimages/Products/RK73H/RK73H.pdf
R39 R46 R49 = RES_18K_0402_1%: 18K 0.063W 1% 0402 (1005 Metric); Manufacturer: KOA Speer; PartNumber: RK73H1ETTP1802F; Tolerance: 1%; Power: 0.063W; Mounting Technology: Surface Mount; PackageReference: 0402; PackageDescription: 0402 (1005 Metric); ComponentLink1Description: Datasheet; ComponentLink1URL: http://www.koaspeer.com/catimages/Products/RK73H/RK73H.pdf
R40 = RES_4K7_0402_1%: as R17 on sheet MCU; Tolerance: 1%; Power: 0.063W; Mounting Technology: Surface Mount; PackageReference: 0402; PackageDescription: 0402 (1005 Metric); ComponentLink1Description: Datasheet; ComponentLink1URL: http://www.koaspeer.com/catimages/Products/RK73H/RK73H.pdf
R41 R44 R45 R47 R48 = RES_10K_0402_1%: as R14 on sheet MCU; Tolerance: 1%; Power: 0.063W; Mounting Technology: Surface Mount; PackageReference: 0402; PackageDescription: 0402 (1005 Metric); ComponentLink1Description: Datasheet; ComponentLink1URL: http://www.koaspeer.com/catimages/Products/RK73H/RK73H.pdf
R42 R43 = RES_50R_1206_2%: 50R 2.4W 2% 1206 (3216 Metric); Manufacturer: Vishay; PartNumber: RCP1206W50R0GEB; Tolerance: 2%; Power: 2.4W; Mounting Technology: Surface Mount; PackageReference: 1206; PackageDescription: 1206 (3216 Metric); ComponentLink1Description: Datasheet; ComponentLink1URL: http://www.vishay.com/docs/31098/rcp.pdf
R50 R51 = RES_100R_0402_1%: 100R 0.063W 1% 0402 (1005 Metric); Manufacturer: KOA Speer; PartNumber: RK73H1ETTP1000F; Power: 0.063W; Tolerance: 1%; Mounting Technology: Surface Mount; PackageReference: 0402; PackageDescription: 0402 (1005 Metric); ComponentLink1Description: Datasheet; ComponentLink1URL: http://www.koaspeer.com/catimages/Products/RK73H/RK73H.pdf
R54-R56 = RES_10M_0402_1%: 10M 0.063W 1% 0402 (1005 Metric); Manufacturer: KOA Speer; PartNumber: RK73H1ETTP1005F; Tolerance: 1%; Power: 0.063W; Mounting Technology: Surface Mount; PackageReference: 0402; PackageDescription: 0402 (1005 Metric); ComponentLink1Description: Datasheet; ComponentLink1URL: http://www.koaspeer.com/catimages/Products/RK73H/RK73H.pdf
R57 R60 = RES_10K_0603_1%: 10K 0.25W 1% 0603 (1005 Metric); Manufacturer: Vishay; PartNumber: RCS060310K0FKEA; Tolerance: 1%; Power: 0.25W; Mounting Technology: Surface Mount; PackageReference: 0603; PackageDescription: 0603 (1608 Metric); ComponentLink1Description: Datasheet; ComponentLink1URL: http://www.vishay.com/docs/20065/rcse3.pdf
U7 = BQ76200PWR: Battery Management Fast high side NCH drive; Manufacturer: Texas Instruments; PartNumber: BQ76200PWR; PackageReference: TSSOP-16; Mounting Technology: Surface Mount

## Sheet LTC6803.SchDoc
size A; SheetNumber: 4
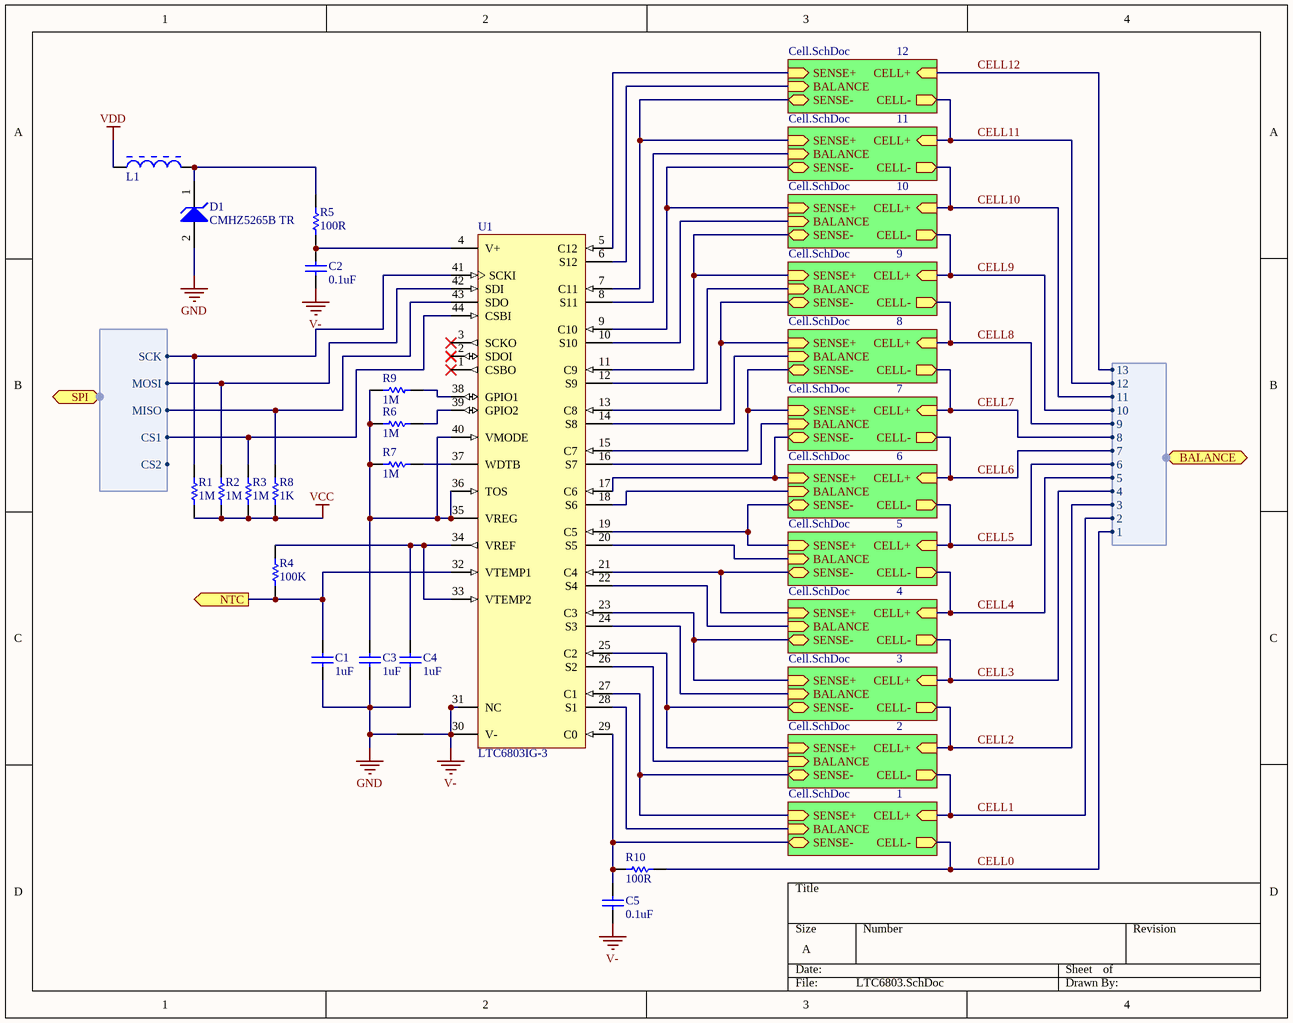
[diagram p4: LTC6803.SchDoc]

### Parts
*  NetTie  [NetTie]  (value not drawn)  (net tie, no BOM)
C1  value 1uF  [C0402[1005X55]]  (hidden comment: 1uF 6.3V 0402)
C2  value 0.1uF  [C0402[1005X55]]  (hidden comment: 0.1uF 100V 0402)
C3  value 1uF  [C0402[1005X55]]  (hidden comment: 1uF 6.3V 0402)
C4  value 1uF  [C0402[1005X55]]  (hidden comment: 1uF 6.3V 0402)
C5  value 0.1uF  [C0402[1005X55]]  (hidden comment: 0.1uF 6.3V 0402)
D1  CMHZ5265B TR  [SOD-123]
L1  MURA-FB-2  [MURA-BLM31-B60-CHIP-2_V3]  (value not drawn)
R1  value 1M  [R0402[1005]]  (hidden comment: 1M 1% 0402)
R2  value 1M  [R0402[1005]]  (hidden comment: 1M 1% 0402)
R3  value 1M  [R0402[1005]]  (hidden comment: 1M 1% 0402)
R4  value 100K  [R0402[1005]]  (hidden comment: 100K 1% 0402)
R5  value 100R  [R0402[1005]]  (hidden comment: 100R 1% 0402)
R6  value 1M  [R0402[1005]]  (hidden comment: 1M 1% 0402)
R7  value 1M  [R0402[1005]]  (hidden comment: 1M 1% 0402)
R8  value 1K  [R0402[1005]]  (hidden comment: 1K 1% 0402)
R9  value 1M  [R0402[1005]]  (hidden comment: 1M 1% 0402)
R10  value 100R  [R0402[1005]]  (hidden comment: 100R 1% 0402)
U1  LTC6803IG-3  [TSSOP-44]

### Sub-sheets
1 = Cell.SchDoc: SENSE+, SENSE- (bidir), BALANCE (in), CELL+ (in), CELL- (out)
2 = Cell.SchDoc: SENSE+, SENSE- (bidir), BALANCE (in), CELL+ (in), CELL- (out)
3 = Cell.SchDoc: SENSE+, SENSE- (bidir), BALANCE (in), CELL+ (in), CELL- (out)
4 = Cell.SchDoc: SENSE+, SENSE- (bidir), BALANCE (in), CELL+ (in), CELL- (out)
5 = Cell.SchDoc: SENSE+, SENSE- (bidir), BALANCE (in), CELL+ (in), CELL- (out)
6 = Cell.SchDoc: SENSE+, SENSE- (bidir), BALANCE (in), CELL+ (in), CELL- (out)
7 = Cell.SchDoc: SENSE+, SENSE- (bidir), BALANCE (in), CELL+ (in), CELL- (out)
8 = Cell.SchDoc: SENSE+, SENSE- (bidir), BALANCE (in), CELL+ (in), CELL- (out)
9 = Cell.SchDoc: SENSE+, SENSE- (bidir), BALANCE (in), CELL+ (in), CELL- (out)
10 = Cell.SchDoc: SENSE+, SENSE- (bidir), BALANCE (in), CELL+ (in), CELL- (out)
11 = Cell.SchDoc: SENSE+, SENSE- (bidir), BALANCE (in), CELL+ (in), CELL- (out)
12 = Cell.SchDoc: SENSE+, SENSE- (bidir), BALANCE (in), CELL+ (in), CELL- (out)

### Ports
BALANCE (harness Balance), NTC (out), SPI (harness SPI)

### Harnesses
SPI: SCK, MOSI, MISO, CS1, CS2
Balance: 13, 12, 11, 10, 9, 8, 6, 7, 5, 3, 4, 2, 1

### Nets
GND: *.1 C1.1 C3.1 C4.1 D1.2(A)
V-: *.2 C2.1 C5.1 U1.30(V-) U1.31(NC)
VCC: R1.1 R2.1 R3.1 R8.2
VDD: L1.1
CELL0: R10.2 ; sheet 1/CELL-, port BALANCE.1
CELL1: sheet 2/CELL-, sheet 1/CELL+, port BALANCE.2
CELL2: sheet 3/CELL-, sheet 2/CELL+, port BALANCE.3
CELL3: sheet 4/CELL-, sheet 3/CELL+, port BALANCE.4
CELL4: sheet 5/CELL-, sheet 4/CELL+, port BALANCE.5
CELL5: sheet 6/CELL-, sheet 5/CELL+, port BALANCE.6
CELL6: sheet 7/CELL-, sheet 6/CELL+, port BALANCE.7
CELL7: sheet 8/CELL-, sheet 7/CELL+, port BALANCE.8
CELL8: sheet 9/CELL-, sheet 8/CELL+, port BALANCE.9
CELL9: sheet 10/CELL-, sheet 9/CELL+, port BALANCE.10
CELL10: sheet 11/CELL-, sheet 10/CELL+, port BALANCE.11
CELL11: sheet 12/CELL-, sheet 11/CELL+, port BALANCE.12
CELL12: sheet 12/CELL+, port BALANCE.13
SPI.CS1: R3.2 U1.44(CSBI) ; port SPI.CS1
SPI.MISO: R8.1 U1.43(SDO) ; port SPI.MISO
SPI.MOSI: R2.2 U1.42(SDI) ; port SPI.MOSI
SPI.SCK: R1.2 U1.41(SCKI) ; port SPI.SCK
NetC1_2: C1.2 R4.1 U1.32(VTEMP1) ; port NTC
NetC2_2: C2.2 R5.1 U1.4(V+)
NetC3_2: C3.2 R6.2 R7.2 R9.2 U1.35(VREG) U1.36(TOS) U1.40(VMODE)
NetC4_2: C4.2 R4.2 U1.33(VTEMP2) U1.34(VREF)
NetC5_2: C5.2 R10.1 U1.29(C0) ; sheet 1/SENSE-
NetC23_1_2: U1.27(C1) ; sheet 2/SENSE-, sheet 1/SENSE+
NetC23_2_2: U1.25(C2) ; sheet 3/SENSE-, sheet 2/SENSE+
NetC23_3_2: U1.23(C3) ; sheet 4/SENSE-, sheet 3/SENSE+
NetC23_4_2: U1.21(C4) ; sheet 5/SENSE-, sheet 4/SENSE+
NetC23_5_2: U1.19(C5) ; sheet 6/SENSE-, sheet 5/SENSE+
NetC23_6_2: U1.17(C6) ; sheet 7/SENSE-, sheet 6/SENSE+
NetC23_7_2: U1.15(C7) ; sheet 8/SENSE-, sheet 7/SENSE+
NetC23_8_2: U1.13(C8) ; sheet 9/SENSE-, sheet 8/SENSE+
NetC23_9_2: U1.11(C9) ; sheet 10/SENSE-, sheet 9/SENSE+
NetC23_10_2: U1.9(C10) ; sheet 11/SENSE-, sheet 10/SENSE+
NetC23_11_2: U1.7(C11) ; sheet 12/SENSE-, sheet 11/SENSE+
NetC23_12_2: U1.5(C12) ; sheet 12/SENSE+
NetD1_1: D1.1(K) L1.2 R5.2
NetQ3_1_1: U1.28(S1) ; sheet 1/BALANCE
NetQ3_2_1: U1.26(S2) ; sheet 2/BALANCE
NetQ3_3_1: U1.24(S3) ; sheet 3/BALANCE
NetQ3_4_1: U1.22(S4) ; sheet 4/BALANCE
NetQ3_5_1: U1.20(S5) ; sheet 5/BALANCE
NetQ3_6_1: U1.18(S6) ; sheet 6/BALANCE
NetQ3_7_1: U1.16(S7) ; sheet 7/BALANCE
NetQ3_8_1: U1.14(S8) ; sheet 8/BALANCE
NetQ3_9_1: U1.12(S9) ; sheet 9/BALANCE
NetQ3_10_1: U1.10(S10) ; sheet 10/BALANCE
NetQ3_11_1: U1.8(S11) ; sheet 11/BALANCE
NetQ3_12_1: U1.6(S12) ; sheet 12/BALANCE
NetR6_1: R6.1 U1.39(GPIO2)
NetR7_1: R7.1 U1.37(WDTB)
NetR9_1: R9.1 U1.38(GPIO1)

Not connected (* = marked no-connect by the designer): U1 1(CSBO)* 2(SDOI)* 3(SCKO)*

### Library data of the parts
C1 C3 C4 = CAP_1uF_6.3V_0402_10%: as C26 on sheet 3V3; Tolerance: 10%; Mounting Technology: Surface Mount; PackageReference: 0402; PackageDescription: 0402 (1005 Metric); Voltage: 6.3V
C2 = CAP_0.1uF_100V_0402_10%: as C38 on sheet Switches; Tolerance: 10%; Mounting Technology: Surface Mount; PackageReference: 0402; PackageDescription: 0402 (1005 Metric); Voltage: 100V
C5 = CAP_0.1uF_6.3V_0402_10%: as C13 on sheet MCU; Tolerance: 10%; Mounting Technology: Surface Mount; PackageReference: 0402; PackageDescription: 0402 (1005 Metric); Voltage: 6.3V
D1 = CMHZ5265B: Zener Diodes 500mW Zener Diode 185mA 58.9V to 2V; Manufacturer: Central Semiconductor; PartNumber: CMHZ5265B TR; Mounting Technology: Surface Mount; PackageReference: SOD-123; PackageDescription: SOD, 2-Leads, Body 2.69x1.6mm
L1 = MURA-FB-2: EMI Filter Beads, Chips & Arrays 1206 33 OHM; PartNumber: BLM31PG330SN1L; Manufacturer: Murata; Mounting Technology: Surface Mount; PackageReference: 1206; PackageDescription: 1206 (3216 Metric)
R1-R3 R6 R7 R9 = RES_1M_0402_1%: 1M 0.063W 1% 0402 (1005 Metric); Manufacturer: KOA Speer; PartNumber: RK73H1ETTP1004F; Power: 0.063W; Tolerance: 1%; Mounting Technology: Surface Mount; PackageReference: 0402; PackageDescription: 0402 (1005 Metric); ComponentLink1Description: Datasheet; ComponentLink1URL: http://www.koaspeer.com/catimages/Products/RK73H/RK73H.pdf
R4 = RES_100K_0402_1%: 100K 0.063W 1% 0402 (1005 Metric); Manufacturer: KOA Speer; PartNumber: RK73H1ETTP1003F; Power: 0.063W; Tolerance: 1%; Mounting Technology: Surface Mount; PackageReference: 0402; PackageDescription: 0402 (1005 Metric); ComponentLink1Description: Datasheet; ComponentLink1URL: http://www.koaspeer.com/catimages/Products/RK73H/RK73H.pdf
R5 R10 = RES_100R_0402_1%: as R50 on sheet Switches; Power: 0.063W; Tolerance: 1%; Mounting Technology: Surface Mount; PackageReference: 0402; PackageDescription: 0402 (1005 Metric); ComponentLink1Description: Datasheet; ComponentLink1URL: http://www.koaspeer.com/catimages/Products/RK73H/RK73H.pdf
R8 = RES_1K_0402_1%: 1K 0.063W 1% 0402 (1005 Metric); Manufacturer: KOA Speer; PartNumber: RK73H1ETTP1001F; Tolerance: 1%; Power: 0.063W; Mounting Technology: Surface Mount; PackageReference: 0402; PackageDescription: 0402 (1005 Metric); ComponentLink1Description: Datasheet; ComponentLink1URL: http://www.koaspeer.com/catimages/Products/RK73H/RK73H.pdf
U1 = LTC6803IG-3: PartNumber: LTC6803IG-3#PBF; Manufacturer: Linear Technology; PackageReference: TSSOP-44; Mounting Technology: Surface Mount; PackageDescription: SOP, 44-Leads, Body 13.1x5.6mm, Pitch 0.5mm

## Sheet Cell.SchDoc
size A; SheetNumber: 5
Used 12 times, as channels U_LTC6803/12, U_LTC6803/11, U_LTC6803/10, U_LTC6803/9, U_LTC6803/8, U_LTC6803/7, U_LTC6803/6, U_LTC6803/5, U_LTC6803/4, U_LTC6803/3, U_LTC6803/2, U_LTC6803/1. Parts and nets are listed once, with the designators drawn on the sheet.
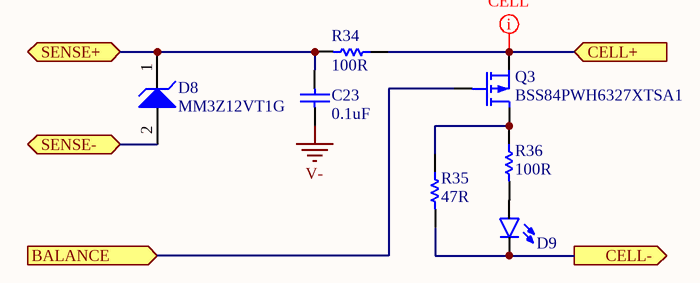
[diagram p5: Cell.SchDoc]

### Parts
C23  value 0.1uF  [C0402[1005X55]]  (hidden comment: 0.1uF 100V 0402)
D8  MM3Z12VT1G  [SOD-323]
D9  LED_0603_BLUE_5mA  [LED0603]  (value not drawn)
Q3  BSS84PWH6327XTSA1  [SOT323-3]
R34  value 100R  [R0402[1005]]  (hidden comment: 100R 1% 0402)
R35  value 47R  [R0805[2012]]  (hidden comment: 47R 5% 0805)
R36  value 100R  [R0402[1005]]  (hidden comment: 100R 1% 0402)

### Ports
BALANCE (in), CELL+ (in), CELL- (out), SENSE+, SENSE- (bidir)

### Nets
V-: C23.1
BALANCE: Q3.1(G) ; port BALANCE
CELL+: Q3.2(S) R34.2 ; port CELL+
CELL-: D9.C R35.1 ; port CELL-
SENSE+: C23.2 D8.1(K) R34.1 ; port SENSE+
SENSE-: D8.2(A) ; port SENSE-
NetD9_A: D9.A R36.1
NetQ3_3: Q3.3(D) R35.2 R36.2

### Channels
U_LTC6803/12: designators end in _12; ports BALANCE=NetQ3_12_1 CELL+=CELL12 CELL-=CELL11 SENSE+=NetC23_12_2 SENSE-=NetC23_11_2
U_LTC6803/11: designators end in _11; ports BALANCE=NetQ3_11_1 CELL+=CELL11 CELL-=CELL10 SENSE+=NetC23_11_2 SENSE-=NetC23_10_2
U_LTC6803/10: designators end in _10; ports BALANCE=NetQ3_10_1 CELL+=CELL10 CELL-=CELL9 SENSE+=NetC23_10_2 SENSE-=NetC23_9_2
U_LTC6803/9: designators end in _9; ports BALANCE=NetQ3_9_1 CELL+=CELL9 CELL-=CELL8 SENSE+=NetC23_9_2 SENSE-=NetC23_8_2
U_LTC6803/8: designators end in _8; ports BALANCE=NetQ3_8_1 CELL+=CELL8 CELL-=CELL7 SENSE+=NetC23_8_2 SENSE-=NetC23_7_2
U_LTC6803/7: designators end in _7; ports BALANCE=NetQ3_7_1 CELL+=CELL7 CELL-=CELL6 SENSE+=NetC23_7_2 SENSE-=NetC23_6_2
U_LTC6803/6: designators end in _6; ports BALANCE=NetQ3_6_1 CELL+=CELL6 CELL-=CELL5 SENSE+=NetC23_6_2 SENSE-=NetC23_5_2
U_LTC6803/5: designators end in _5; ports BALANCE=NetQ3_5_1 CELL+=CELL5 CELL-=CELL4 SENSE+=NetC23_5_2 SENSE-=NetC23_4_2
U_LTC6803/4: designators end in _4; ports BALANCE=NetQ3_4_1 CELL+=CELL4 CELL-=CELL3 SENSE+=NetC23_4_2 SENSE-=NetC23_3_2
U_LTC6803/3: designators end in _3; ports BALANCE=NetQ3_3_1 CELL+=CELL3 CELL-=CELL2 SENSE+=NetC23_3_2 SENSE-=NetC23_2_2
U_LTC6803/2: designators end in _2; ports BALANCE=NetQ3_2_1 CELL+=CELL2 CELL-=CELL1 SENSE+=NetC23_2_2 SENSE-=NetC23_1_2
U_LTC6803/1: designators end in _1; ports BALANCE=NetQ3_1_1 CELL+=CELL1 CELL-=CELL0 SENSE+=NetC23_1_2 SENSE-=NetC5_2

### Layout directives
net class CELL: CELL12

### Library data of the parts
C23 = CAP_0.1uF_100V_0402_10%: as C38 on sheet Switches; Tolerance: 10%; Mounting Technology: Surface Mount; PackageReference: 0402; PackageDescription: 0402 (1005 Metric); Voltage: 100V
D8 = MM3Z12VT1G: Zener Voltage Regulator, 300 mW, 2-Pin SOD-323, Tape and Reel; Manufacturer: ON Semiconductor; Mounting Technology: Surface Mount; PackageDescription: SOD, 2-Leads; PartNumber: MM3Z12VT1G; PackageReference: SOD-323
D9 = LED_0603_BLUE_5mA: PartNumber: LTST-C193TBKT-5A; Manufacturer: Lite-On Inc.; PackageReference: 0603; PackageDescription: 0603 (1608 Metric); Mounting Technology: Surface Mount
Q3 = BSS84PW H6327: P-Channel MOSFET; Manufacturer: Infineon; Mounting Technology: Surface Mount; PartNumber: BSS84PWH6327XTSA1; PackageReference: SOT323-3
R34 R36 = RES_100R_0402_1%: as R50 on sheet Switches; Power: 0.063W; Tolerance: 1%; Mounting Technology: Surface Mount; PackageReference: 0402; PackageDescription: 0402 (1005 Metric); ComponentLink1Description: Datasheet; ComponentLink1URL: http://www.koaspeer.com/catimages/Products/RK73H/RK73H.pdf
R35 = RES_47R_0805_5%: 47R 0.5W 5% 0805 (2012 Metric); Manufacturer: Panasonic; PartNumber: ERJ-P06J470V; Tolerance: 5%; Power: 0.5W; Mounting Technology: Surface Mount; PackageReference: 0805; PackageDescription: 0805 (2012 Metric); ComponentLink1Description: Datasheet; ComponentLink1URL: https://industrial.panasonic.com/cdbs/www-data/pdf/RDA0000/AOA0000C243.pdf

## Sheet Charging.SchDoc
size A; SheetNumber: 6
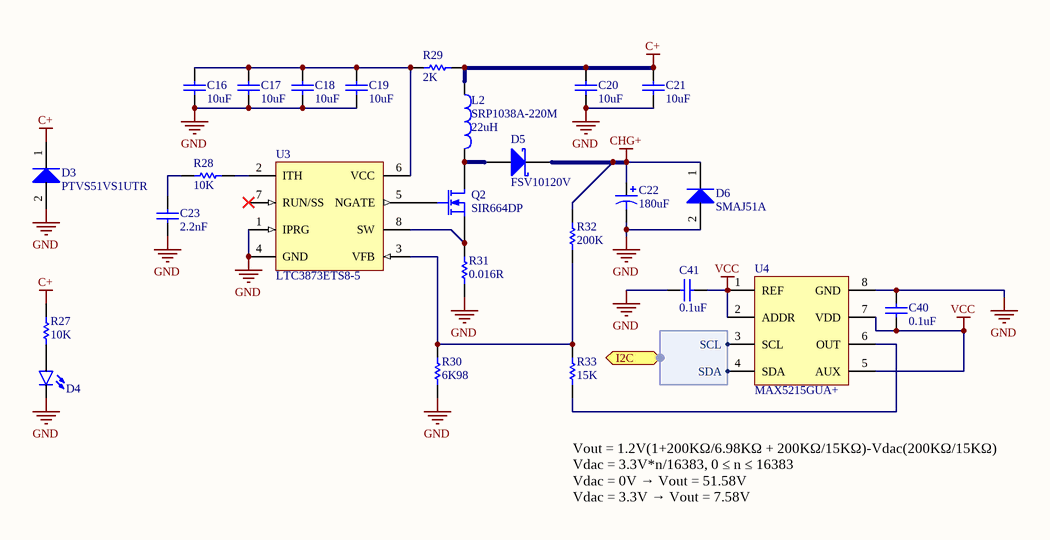
[diagram p6: Charging.SchDoc]

### Parts
C16  value 10uF  [C0603[1608X92]]  (hidden comment: 10uF 35V 0603)
C17  value 10uF  [C0603[1608X92]]  (hidden comment: 10uF 35V 0603)
C18  value 10uF  [C0603[1608X92]]  (hidden comment: 10uF 35V 0603)
C19  value 10uF  [C0603[1608X92]]  (hidden comment: 10uF 35V 0603)
C20  value 10uF  [C1206[3216X160]]  (hidden comment: 10uF 50V 1206)
C21  value 10uF  [C1206[3216X160]]  (hidden comment: 10uF 50V 1206)
C22  value 180uF  [CAP-ELECTROLYTIC[10.0x12.6]]  (hidden comment: 180uF 50V)
C23  value 2.2nF  [C0402[1005X55]]  (hidden comment: 2.2nF 50V 0402)
C40  value 0.1uF  [C0402[1005X55]]  (hidden comment: 0.1uF 6.3V 0402)
C41  value 0.1uF  [C0402[1005X55]]  (hidden comment: 0.1uF 6.3V 0402)
D3  PTVS51VS1UTR  [SOD-123W]
D4  LED_0603_GREEN_5mA  [LED0603]  (value not drawn)
D5  FSV10120V  [TO-277]
D6  SMAJ51A  [DO-214AC]
L2  SRP1038A-220M  value 22uH  [SRP1038A]
Q2  SIR664DP  [PowerPak-8]
R27  value 10K  [R0603[1608]]  (hidden comment: 10K 1% 0603)
R28  value 10K  [R0402[1005]]  (hidden comment: 10K 1% 0402)
R29  value 2K  [R0603[1608]]  (hidden comment: 2K 2% 0603)
R30  value 6K98  [R0402[1005]]  (hidden comment: 6K98 1% 0402)
R31  value 0.016R  [R1206[3216]]  (hidden comment: 0.016R 1% 1206)
R32  value 200K  [R0402[1005]]  (hidden comment: 200K 1% 0402)
R33  value 15K  [R0402[1005]]  (hidden comment: 15K 1% 0402)
U3  LTC3873ETS8-5  [SOT-23-8]
U4  MAX5215GUA+  [MSOP-8]

### Ports
I2C (harness I2C)

### Harnesses
I2C: SCL, SDA

### Nets
C+: C20.2 C21.2 D3.1(K) L2.1 R27.2 R29.2
CHG+: C22.1 D5.1(K) D6.1(K) R32.2
GND: C16.1 C17.1 C18.1 C19.1 C20.1 C21.1 C22.2 C23.1 C40.1 C41.1 D3.2(A) D4.C D6.2(A) R30.1 R31.1 U3.1(IPRG) U3.4(GND) U4.8(GND)
VCC: C40.2 C41.2 U4.1(REF) U4.2(ADDR) U4.5(AUX) U4.7(VDD)
I2C.SCL: U4.3(SCL) ; port I2C.SCL
I2C.SDA: U4.4(SDA) ; port I2C.SDA
NetC16_2: C16.2 C17.2 C18.2 C19.2 R29.1 U3.6(VCC)
NetC23_2: C23.2 R28.2
NetD4_A: D4.A R27.1
NetD5_2: D5.2(A) L2.2 Q2.3(D)
NetQ2_1: Q2.1(S) R31.2 U3.8(SW)
NetQ2_2: Q2.2(G) U3.5(NGATE)
NetR28_1: R28.1 U3.2(ITH)
NetR30_2: R30.2 R32.1 R33.2 U3.3(VFB)
NetR33_1: R33.1 U4.6(OUT)

Not connected (* = marked no-connect by the designer): U3 7(RUN/SS)*

### Notes on the sheet
- Vout = 1.2V(1+200KΩ/6.98KΩ + 200KΩ/15KΩ)-Vdac(200KΩ/15KΩ)
  Vdac = 3.3V*n/16383, 0 ≤ n ≤ 16383
  Vdac = 0V → Vout = 51.58V
  Vdac = 3.3V → Vout = 7.58V

### Library data of the parts
C16-C19 = CAP_10uF_35V_0603_10%: 10uF 35V 10% 0603 (1608 Metric); PartNumber: GRM188R6YA106MA73D; Manufacturer: Murata; Mounting Technology: Surface Mount; PackageReference: 0603; PackageDescription: 0603 (1608 Metric); Voltage: 35V; Tolerance: 10%
C20 C21 = CAP_10uF_50V_1206_20%: 10uF 50V 20% 1206 (3216 Metric); PartNumber: UMK316BBJ106ML-T; Manufacturer: Taiyo Yuden; Tolerance: 20%; Mounting Technology: Surface Mount; PackageReference: 1206; PackageDescription: 1206 (3216 Metric); Voltage: 50V
C22 = CAP_180uF_50V_20%: 180uF 50V 20%; PartNumber: PCR1H181MCL1GS; Manufacturer: Nichicon; PackageReference: 1H; PackageDescription: 10x12.7mm; Mounting Technology: Surface Mount; Voltage: 50V; Tolerance: 20%
C23 = CAP_2.2nF_50V_0402_10%: 2.2nF 50V 10% 0402 (1005 Metric); PartNumber: GCM155R71H222KA37D; Manufacturer: Murata; Tolerance: 10%; Mounting Technology: Surface Mount; PackageReference: 0402; PackageDescription: 0402 (1005 Metric); Voltage: 50V
C40 C41 = CAP_0.1uF_6.3V_0402_10%: as C13 on sheet MCU; Mounting Technology: Surface Mount; PackageReference: 0402; PackageDescription: 0402 (1005 Metric); Voltage: 6.3V; Tolerance: 10%
D3 = PTVS51VS1UTR,115: Manufacturer: NXP; Mounting Technology: Surface Mount; PartNumber: PTVS51VS1UTR,115; PackageReference: SOD-123W; PackageDescription: SOD123W, 2-Leads
D4 = LED_0603_GREEN_5mA: as D13 on sheet 3V3; PackageReference: 0603; PackageDescription: 0603 (1608 Metric); Mounting Technology: Surface Mount
D5 = FSV10120V: Schottky Diodes & Rectifiers 10 Amp 120V Schottky Rectifier; Manufacturer: Fairchild Semiconductor; PackageReference: TO-277-3; PartNumber: FSV10120V; Mounting Technology: Surface Mount
D6 = SMAJ51A-E3/61: Manufacturer: Vishay; PartNumber: SMAJ51A-E3/61; PackageReference: DO-214AC; PackageDescription: DO-214AC, 2 Leads; Mounting Technology: Surface Mount
L2 = SRP1038A-220M: 22uH 20% 7A 1038; Manufacturer: Bourns; PackageReference: SRP1038A; PartNumber: SRP1038A-220M; Mounting Technology: Surface Mount
Q2 = SIR664DP-T1-GE3: N-Channel MOSFET; Manufacturer: Vishay; PartNumber: SIR664DP-T1-GE3; Mounting Technology: Surface Mount; PackageReference: PowerPAK-8
R27 = RES_10K_0603_1%: as R57 on sheet Switches; Power: 0.25W; Tolerance: 1%; Mounting Technology: Surface Mount; PackageReference: 0603; PackageDescription: 0603 (1608 Metric); ComponentLink1Description: Datasheet; ComponentLink1URL: http://www.vishay.com/docs/20065/rcse3.pdf
R28 = RES_10K_0402_1%: as R14 on sheet MCU; Tolerance: 1%; Power: 0.063W; Mounting Technology: Surface Mount; PackageReference: 0402; PackageDescription: 0402 (1005 Metric); ComponentLink1Description: Datasheet; ComponentLink1URL: http://www.koaspeer.com/catimages/Products/RK73H/RK73H.pdf
R29 = RES_2K_0603_2%: 2K 1.5W 2% 0603 (1005 Metric); Manufacturer: Vishay; PartNumber: RCP0603W2K00GEB; Tolerance: 2%; Power: 1.5W; Mounting Technology: Surface Mount; PackageReference: 0603; PackageDescription: 0603 (1608 Metric); ComponentLink1Description: Datasheet; ComponentLink1URL: http://www.vishay.com/docs/20043/crcwhpe3.pdf
R30 = RES_6K98_0402_1%: 6K98 0.063W 1% 0402 (1005 Metric); Manufacturer: KOA Speer; PartNumber: RK73H1ETTP6981F; Power: 0.063W; Tolerance: 1%; Mounting Technology: Surface Mount; PackageReference: 0402; PackageDescription: 0402 (1005 Metric); ComponentLink1Description: Datasheet; ComponentLink1URL: http://www.koaspeer.com/catimages/Products/RK73H/RK73H.pdf
R31 = RES_0.016R_1206_1%: 0.016R 1W 1% 1206 (3216 Metric); Manufacturer: Panasonic; PartNumber: ERJ-8CWFR016V; Power: 1W; Tolerance: 1%; Mounting Technology: Surface Mount; PackageReference: 1206; PackageDescription: 1206 (3216 Metric); ComponentLink1Description: Datasheet; ComponentLink1URL: https://industrial.panasonic.com/cdbs/www-data/pdf/RDA0000/AOA0000C239.pdf
R32 = RES_200K_0402_1%: as R22 on sheet MCU; Power: 0.063W; Tolerance: 1%; Mounting Technology: Surface Mount; PackageReference: 0402; PackageDescription: 0402 (1005 Metric); ComponentLink1Description: Datasheet; ComponentLink1URL: http://www.koaspeer.com/catimages/Products/RK73H/RK73H.pdf
R33 = RES_15K_0402_1%: 15K 0.063W 1% 0402 (1005 Metric); Manufacturer: KOA Speer; PartNumber: RK73H1ETTP1502F; Tolerance: 1%; Power: 0.063W; Mounting Technology: Surface Mount; PackageReference: 0402; PackageDescription: 0402 (1005 Metric); ComponentLink1Description: Datasheet; ComponentLink1URL: http://www.koaspeer.com/catimages/Products/RK73H/RK73H.pdf
U3 = LTC3873ETS8: PartNumber: LTC3873ETS8-5#PBF; Manufacturer: Linear Technology; PackageReference: TSOT-23-8; Mounting Technology: Surface Mount
U4 = MAX5215GUA+: 14 Bit Digital to Analog Converter; Manufacturer: Maxim Integrated; PartNumber: MAX5215GUA+; Mounting Technology: Surface Mount; PackageReference: MSOP-8

## Sheet Connectors.SchDoc
size A; SheetNumber: 13
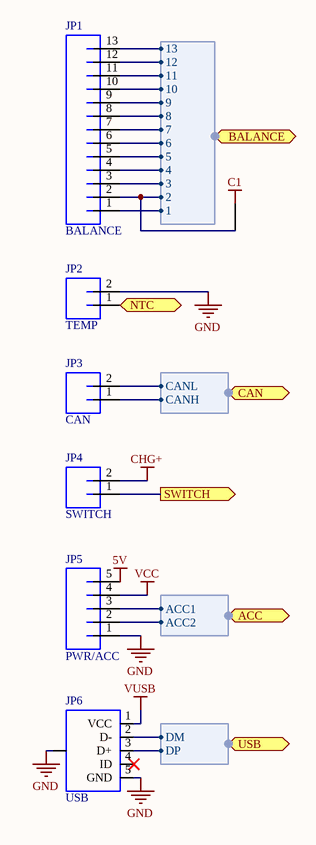
[diagram p7: Connectors.SchDoc]

### Parts
*1  NetTie  [NetTie]  (value not drawn)  (net tie, no BOM)
JP1  BALANCE  [JST-XH-13-PTH-VERT]
JP2  TEMP  [JST-PH-2-PTH-VERT]
JP3  CAN  [JST-PH-2-PTH-VERT]
JP4  SWITCH  [JST-PH-2-PTH-VERT]
JP5  PWR/ACC  [JST-PH-5-PTH-VERT]
JP6  USB  [USB-MICROB]

### Ports
ACC (harness Accessory Outputs), BALANCE (harness Balance), CAN (harness CAN Output), NTC (in), SWITCH (out), USB (harness USB)

### Harnesses
USB: DM, DP
Accessory Outputs: ACC1, ACC2
CAN Output: CANL, CANH
Balance: 13, 12, 11, 10, 9, 8, 6, 7, 5, 3, 4, 2, 1

### Nets
5V: JP5.5
C1: *1.2
CHG+: JP4.2
GND: JP2.2 JP5.1 JP6.5(GND) JP6.6(SHIELD)
VCC: JP5.4
VUSB: JP6.1(VCC)
ACC.ACC1: JP5.3 ; port ACC.ACC1
ACC.ACC2: JP5.2 ; port ACC.ACC2
CELL0: JP1.1 ; port BALANCE.1
CELL1: *1.1 JP1.2 ; port BALANCE.2
CELL2: JP1.3 ; port BALANCE.3
CELL3: JP1.4 ; port BALANCE.4
CELL4: JP1.5 ; port BALANCE.5
CELL5: JP1.6 ; port BALANCE.6
CELL6: JP1.7 ; port BALANCE.7
CELL7: JP1.8 ; port BALANCE.8
CELL8: JP1.9 ; port BALANCE.9
CELL9: JP1.10 ; port BALANCE.10
CELL10: JP1.11 ; port BALANCE.11
CELL11: JP1.12 ; port BALANCE.12
CELL12: JP1.13 ; port BALANCE.13
USB.DM: JP6.2(D-) ; port USB.DM
USB.DP: JP6.3(D+) ; port USB.DP
NetC1_2: JP2.1 ; port NTC
NetJP3_1: JP3.1 ; port CAN.CANH
NetJP3_2: JP3.2 ; port CAN.CANL
NetJP4_1: JP4.1 ; port SWITCH

Not connected (* = marked no-connect by the designer): JP6 4(ID)*

### Library data of the parts
JP1 = JST_XH_13_VERT: Manufacturer: JST Sales America, Inc.; PartNumber: B13B-XH-A(LF)(SN); Mounting Technology: Through Hole; PackageReference: JST-XH
JP2-JP4 = JST_PH_2_VERT: Manufacturer: JST Sales America, Inc.; PartNumber: B2B-PH-K-S(LF)(SN); Mounting Technology: Through Hole; PackageReference: JST-PH
JP5 = JST_PH_5_VERT: Manufacturer: JST Sales America, Inc.; PartNumber: B5B-PH-K-S(LF)(SN); PackageReference: JST-PH; Mounting Technology: Through Hole
JP6 = USB_MICROB_SMT: pin to pad: 1>VBUS 2>D- 3>D+ 4>ID 5>GND 6>MT1+P$1+P$2+MT2; PartNumber: 10118192-0001LF; Manufacturer: Amphenol FCI; Mounting Technology: Surface Mount; PackageReference: USB - Micro B

## Sheet CurrentSense.SchDoc
size A; SheetNumber: 8
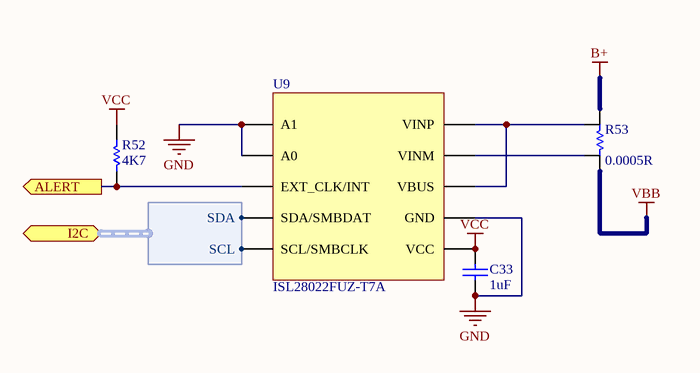
[diagram p8: CurrentSense.SchDoc]

### Parts
C33  value 1uF  [C0402[1005X55]]  (hidden comment: 1uF 6.3V 0402)
R52  value 4K7  [R0402[1005]]  (hidden comment: 4K7 1% 0402)
R53  value 0.0005R  [WSL2726]
U9  ISL28022FUZ-T7A  [MSOP-10]

### Ports
ALERT (out), I2C (harness I2C)

### Harnesses
I2C: SCL, SDA

### Nets
B+: R53.2
GND: C33.1 U9.1(A1) U9.2(A0) U9.7(GND)
VBB: R53.1
VCC: C33.2 R52.2 U9.6(VCC)
I2C.SCL: U9.5(SCL/SMBCLK) ; port I2C.SCL
I2C.SDA: U9.4(SDA/SMBDAT) ; port I2C.SDA
NetR52_1: R52.1 U9.3(EXT_CLK/INT) ; port ALERT
NetR53_3: R53.3 U9.9(VINM)
NetR53_4: R53.4 U9.8(VBUS) U9.10(VINP)

### Library data of the parts
C33 = CAP_1uF_6.3V_0402_10%: as C26 on sheet 3V3; Tolerance: 10%; Mounting Technology: Surface Mount; PackageReference: 0402; PackageDescription: 0402 (1005 Metric); Voltage: 6.3V
R52 = RES_4K7_0402_1%: as R17 on sheet MCU; Tolerance: 1%; Power: 0.063W; Mounting Technology: Surface Mount; PackageReference: 0402; PackageDescription: 0402 (1005 Metric); ComponentLink1Description: Datasheet; ComponentLink1URL: http://www.koaspeer.com/catimages/Products/RK73H/RK73H.pdf
R53 = WSLP2726: Current Sense Resistor, 0.0005R; PartNumber: WSLP2726L5000FEA; Manufacturer: Vishay / Dale; Power: 7W; Tolerance: 1%; PackageReference: 2726; Mounting Technology: Surface Mount
U9 = ISL28022FUZ-T7A: Manufacturer: Intersil; PartNumber: ISL28022FUZ-T7A; Mounting Technology: Surface Mount; PackageReference: MSOP-10